# Altium project Data_Hub.PrjPCB
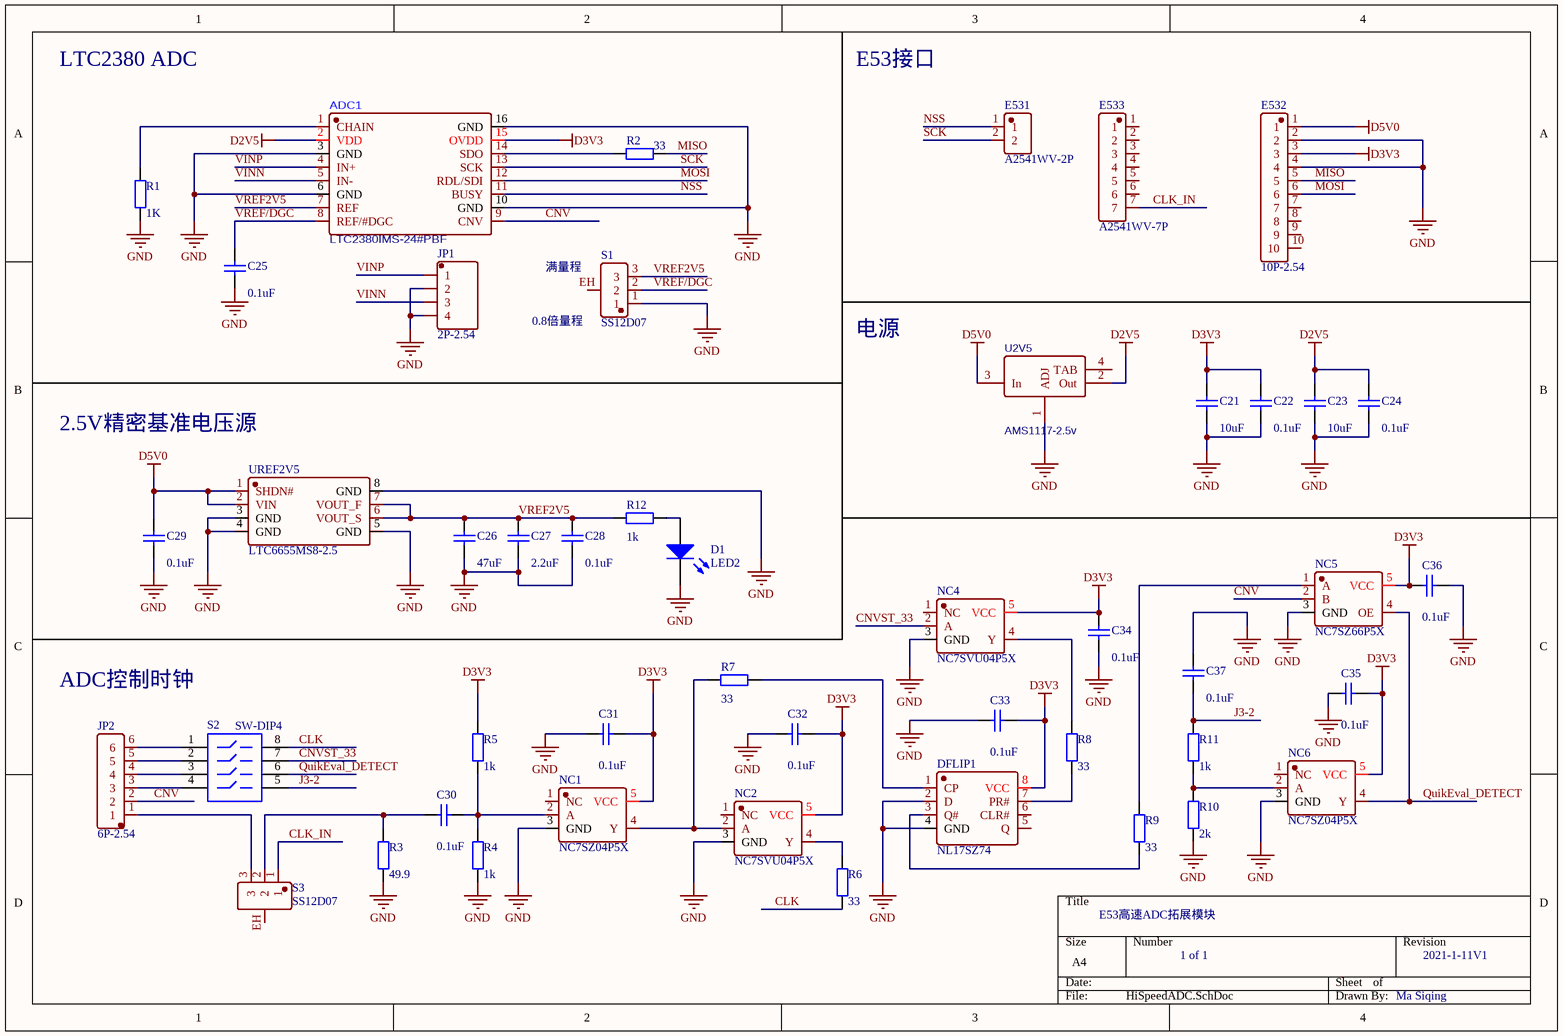
[diagram p0: HiSpeedADC.SchDoc]
1 sheet, 47 parts. Net scope: global (net labels, ports and power ports of the same name join across sheets).
Board file: HiSpeedADC.PcbDoc

## Sheet HiSpeedADC.SchDoc: E53高速ADC拓展模块
size A4; DrawnBy: Ma Siqing; Revision: 2021-1-11V1; SheetNumber: 1 of 1

### Parts
ADC1  LTC2380IMS-24#PBF  [MSOP-16_L4.0-W3.0-P0.50-LS4.9-BL]
C21  value 10uF  [C1206]
C22  value 0.1uF  [C1206]
C23  value 10uF  [C1206]
C24  value 0.1uF  [C1206]
C25  value 0.1uF  [C1206]
C26  value 47uF  [C1206]
C27  value 2.2uF  [C1206]
C28  value 0.1uF  [C1206]
C29  value 0.1uF  [C1206]
C30  value 0.1uF  [C1206]
C31  value 0.1uF  [C1206]
C32  value 0.1uF  [C1206]
C33  value 0.1uF  [C1206]
C34  value 0.1uF  [C1206]
C35  value 0.1uF  [C1206]
C36  value 0.1uF  [C1206]
C37  value 0.1uF  [C1206]
D1  LED2  [3.2X1.6X1.1]
DFLIP1  NL17SZ74  [US-8_L2.4-W2.1-P0.50-LS3.2-BR]
E531  A2541WV-2P  [HDR-TH_P2.54-H-M_A2541WV-2P]
E532  10P-2.54  [HDR-TH_10P-P2.54-V]
E533  A2541WV-7P  [HDR-TH_7P-P2.54-V]
JP1  2P-2.54  [HDR-TH_4P-P2.54-V]
JP2  6P-2.54  [HDR-TH_6P-P2.54-V]
NC1  NC7SZ04P5X  [SC-70-5_L2.1-W1.3-P0.65-LS2.1-BR]
NC2  NC7SVU04P5X  [SC-70-5_L2.1-W1.3-P0.65-LS2.1-BL]
NC4  NC7SVU04P5X  [SC-70-5_L2.1-W1.3-P0.65-LS2.1-BL]
NC5  NC7SZ66P5X  [SC-70-5_L2.1-W1.3-P0.65-LS2.1-BL]
NC6  NC7SZ04P5X  [SC-70-5_L2.1-W1.3-P0.65-LS2.1-BR]
R1  value 1K  [6-0805_N]
R2  value 33  [6-0805_N]
R3  value 49.9  [6-0805_N]
R4  value 1k  [6-0805_N]
R5  value 1k  [6-0805_N]
R6  value 33  [6-0805_N]
R7  value 33  [6-0805_N]
R8  value 33  [6-0805_N]
R9  value 33  [6-0805_N]
R10  value 2k  [6-0805_N]
R11  value 1k  [6-0805_N]
R12  value 1k  [6-0805_N]
S1  SS12D07  [SW-TH_SS-12D07-X-X]
S2  SW-DIP4  [DIP-8]
S3  SS12D07  [SW-TH_SS-12D07-X-X]
U2V5  AMS1117-2.5v  [SOT-223_L6.7-W3.5-P2.30-BR]
UREF2V5  LTC6655MS8-2.5  [US-8_L2.4-W2.1-P0.50-LS3.2-BR]

### Nets
D2V5: ADC1.2(VDD) C23.1 C24.1 U2V5.2(Out)
D3V3: ADC1.15(OVDD) C21.1 C22.1 C31.2 C32.2 C33.1 C34.1 C35.2 C36.1 DFLIP1.8(VCC) E532.3 NC1.5(VCC) NC2.5(VCC) NC4.5(VCC) NC5.5(VCC) NC6.5(VCC) R5.1
D5V0: C29.1 E532.1 U2V5.3(In) UREF2V5.1(SHDN#) UREF2V5.2(VIN)
GND: ADC1.3(GND) ADC1.6(GND) ADC1.10(GND) ADC1.16(GND) C21.2 C22.2 C23.2 C24.2 C25.2 C26.2 C27.2 C28.2 C29.2 C31.1 C32.1 C33.2 C34.2 C35.1 C36.2 C37.2 D1.2(K) DFLIP1.2(D) DFLIP1.4(GND) E532.2 E532.4 JP1.2 JP1.4 NC1.3(GND) NC2.3(GND) NC4.3(GND) NC5.3(GND) NC6.3(GND) R1.1 R3.2 R4.2 R10.1 S1.1 U2V5.1(ADJ) UREF2V5.3(GND) UREF2V5.4(GND) UREF2V5.5(GND) UREF2V5.8(GND)
CLK: R6.1 S2.8
CLK_IN: E533.7 S3.1
CNV: ADC1.9(CNV) JP2.2 NC5.2(B)
CNVST_33: NC4.2(A) S2.7
J3-2: C37.1 R11.2 S2.5
MISO: E532.5 R2.1
MOSI: ADC1.12(RDL/SDI) E532.6
NSS: ADC1.11(BUSY) E531.1
QuikEval_DETECT: NC5.4(OE) NC6.4(Y) S2.6
SCK: ADC1.13(SCK) E531.2
VINN: ADC1.5(IN-) JP1.3
VINP: ADC1.4(IN+) JP1.1
VREF2V5: ADC1.7(REF) C26.1 C27.1 C28.1 R12.2 S1.3 UREF2V5.6(VOUT_S) UREF2V5.7(VOUT_F)
VREF/DGC: ADC1.8(REF/#DGC) C25.1 S1.2
NetADC1_1: ADC1.1(CHAIN) R1.2
NetADC1_14: ADC1.14(SDO) R2.2
NetC30_1: C30.1 R3.1 S3.2
NetC30_2: C30.2 NC1.2(A) R4.1 R5.2
NetD1_1: D1.1(A) R12.1
NetDFLIP1_1: DFLIP1.1(CP) R7.1
NetDFLIP1_3: DFLIP1.3(Q#) R9.1
NetDFLIP1_7: DFLIP1.7(PR#) R8.2
NetJP2_1: JP2.1 S3.3
NetJP2_3: JP2.3 S2.4
NetJP2_4: JP2.4 S2.3
NetJP2_5: JP2.5 S2.2
NetJP2_6: JP2.6 S2.1
NetNC1_4: NC1.4(Y) NC2.2(A) R7.2
NetNC2_4: NC2.4(Y) R6.2
NetNC4_4: NC4.4(Y) R8.1
NetNC5_1: NC5.1(A) R9.2
NetNC6_2: NC6.2(A) R10.2 R11.1

Not connected (* = marked no-connect by the designer): DFLIP1 5(Q) 6(CLR#); E532 7 8 9 10; E533 1 2 3 4 5 6; NC1 1(NC); NC2 1(NC); NC4 1(NC); NC6 1(NC); S1 EH; S3 EH; U2V5 4(TAB)

### Notes on the sheet
- LTC2380 ADC
- E53接口
- (near S1) 满量程
- (near S1) 0.8倍量程
- 电源
- 2.5V精密基准电压源
- ADC控制时钟

### Library data of the parts
C21-C37 = Cap Semi: Capacitor (Semiconductor SIM Model); Published: 8-Jun-2000; LatestRevisionDate: 29-May-2009; LatestRevisionNote: IPC-7351 Footprint Added.; PackageReference: C1206; Publisher: Altium Limited; PackageDescription: Chip Capacitor
D1 = LED2: Typical RED, GREEN, YELLOW, AMBER GaAs LED; Published: 8-Jun-2000; LatestRevisionDate: 17-Jul-2002; LatestRevisionNote: Re-released for DXP Platform.; PackageVersion: Feb-2002; PackageReference: 3.2X1.6X1.1; Publisher: Altium Limited; PackageDescription: SM LED; 2 Flat Leads
R1-R12 = Res2: Resistor; Published: 8-Jun-2000; LatestRevisionDate: 17-Jul-2002; LatestRevisionNote: Re-released for DXP Platform.; PackageReference: AXIAL-0.4; Publisher: Altium Limited; PackageDescription: Axial Device, Thru-Hole; 2 Leads; 0.4 in Pin Spacing
S2 = SW-DIP4: DIP Switch; Published: 24-Mar-1999; LatestRevisionDate: 17-Jul-2002; LatestRevisionNote: Re-released for DXP Platform.; PackageReference: DIP-8; Publisher: Altium Limited
U2V5 = AMS1117-ADJ: BOM_Manufacturer: AMS; sourceId: 0btnFXRxP; Contributor: GerryChen; SMT Type: Extend; BOM_Supplier: LCSC; BOM_Manufacturer Part: AMS1117-ADJ; image: //image.lceda.cn/szlcsc/C6188.jpg; BOM_Supplier Part: C6188; BOM_JLCPCB SMD: Yes; spicePre: U; spiceSymbolName: AMS1117-ADJ
UREF2V5 = LTC6655MS8-5